# Altium project nRF51822.PrjPcb
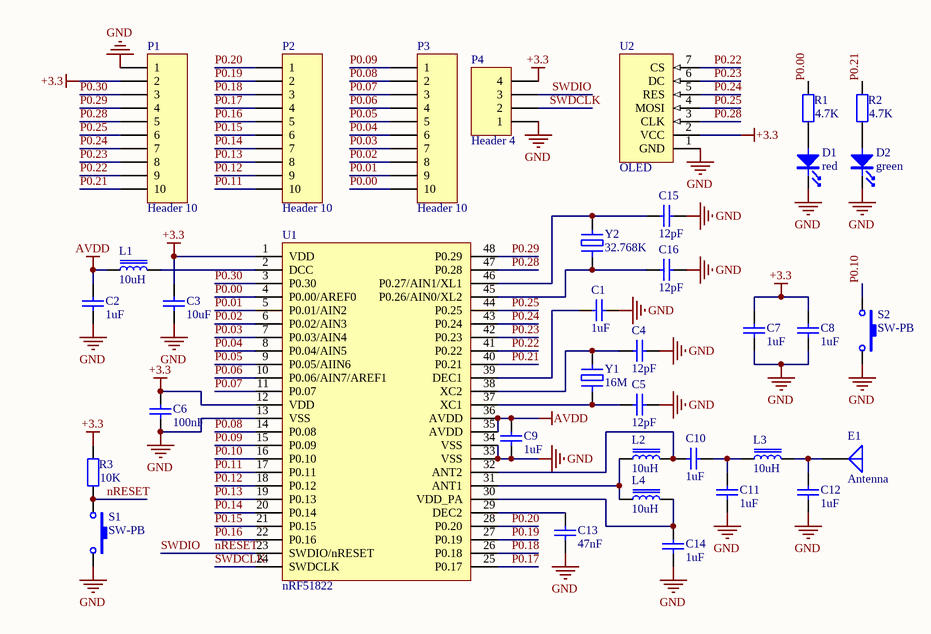
[diagram p0: nRF51822.SchDoc]
1 sheet, 36 parts. Net scope: global (net labels, ports and power ports of the same name join across sheets).
Board file: nRF51822.PcbDoc

## Sheet nRF51822.SchDoc
size A4

### Parts
C1  1uF  [电容_C0603]
C2  1uF  [电容_C0603]
C3  10uF  [电容_C0603]
C4  12pF  [电容_C0603]
C5  12pF  [电容_C0603]
C6  100nF  [电容_C0603]
C7  1uF  [电容_C0603]
C8  1uF  [电容_C0603]
C9  1uF  [电容_C0603]
C10  1uF  [电容_C0603]
C11  1uF  [电容_C0603]
C12  1uF  [电容_C0603]
C13  47nF  [电容_C0603]
C14  1uF  [电容_C0603]
C15  12pF  [电容_C0603]
C16  12pF  [电容_C0603]
D1  red  [LED_0603]
D2  green  [LED_0603]
E1  Antenna  [AN9520]
L1  10uH  [变压器电感_0420]
L2  10uH  [电阻_R0603]
L3  10uH  [电阻_R0603]
L4  10uH  [电阻_R0603]
P1  Header 10  [HDR1X10]
P2  Header 10  [HDR1X10]
P3  Header 10  [HDR1X10]
P4  Header 4  [HDR1X4]
R1  value 4.7K  [电阻_R0603]  (hidden comment: Res2)
R2  value 4.7K  [电阻_R0603]  (hidden comment: Res2)
R3  value 10K  [电阻_R0603]  (hidden comment: Res2)
S1  SW-PB  [SPST4]
S2  SW-PB  [SPST4]
U1  nRF51822  [QFN48 6X6 mm]
U2  OLED  [OLED 0.96]
Y1  F: 16M  [晶振_2016]  (hidden comment: XTAL)
Y2  32.768K  [晶振_3215]

### Nets
+3.3: C3.2 C6.1 C7.2 C8.2 P1.2 P4.4 R3.1 U1.1(VDD) U1.12(VDD) U2.2(VCC)
AVDD: C2.2 C9.1 L1.1 U1.35(AVDD) U1.36(AVDD)
GND: C1.1 C2.1 C3.1 C4.2 C5.2 C6.2 C7.1 C8.1 C9.2 C11.2 C12.2 C13.1 C14.1 C15.2 C16.2 D1.K D2.K P1.1 P4.1 S1.2 S2.2 U1.13(VSS) U1.33(VSS) U1.34(VSS) U2.1(GND)
nRESET: P4.3 R3.2 S1.1 U1.23(SWDIO/nRESET)  [also labelled SWDIO]
P0.00: P3.10 R1.1 U1.4(P0.00/AREF0)
P0.01: P3.9 U1.5(P0.01/AIN2)
P0.02: P3.8 U1.6(P0.02/AIN3)
P0.03: P3.7 U1.7(P0.03/AIN4)
P0.04: P3.6 U1.8(P0.04/AIN5)
P0.05: P3.5 U1.9(P0.05/AIIN6)
P0.06: P3.4 U1.10(P0.06/AIN7/AREF1)
P0.07: P3.3 U1.11(P0.07)
P0.08: P3.2 U1.14(P0.08)
P0.09: P3.1 U1.15(P0.09)
P0.10: S2.1 U1.16(P0.10)
P0.11: P2.10 U1.17(P0.11)
P0.12: P2.9 U1.18(P0.12)
P0.13: P2.8 U1.19(P0.13)
P0.14: P2.7 U1.20(P0.14)
P0.15: P2.6 U1.21(P0.15)
P0.16: P2.5 U1.22(P0.16)
P0.17: P2.4 U1.25(P0.17)
P0.18: P2.3 U1.26(P0.18)
P0.19: P2.2 U1.27(P0.19)
P0.20: P2.1 U1.28(P0.20)
P0.21: P1.10 R2.1 U1.40(P0.21)
P0.22: P1.9 U1.41(P0.22) U2.7(CS)
P0.23: P1.8 U1.42(P0.23) U2.6(DC)
P0.24: P1.7 U1.43(P0.24) U2.5(RES)
P0.25: P1.6 U1.44(P0.25) U2.4(MOSI)
P0.28: P1.5 U1.47(P0.28) U2.3(CLK)
P0.29: P1.4 U1.48(P0.29)
P0.30: P1.3 U1.3(P0.30)
SWDCLK: P4.2 U1.24(SWDCLK)
NetC1_2: C1.2 U1.39(DEC1)
NetC4_1: C4.1 U1.38(XC2) Y1.2
NetC5_1: C5.1 U1.37(XC1) Y1.1
NetC10_1: C10.1 C11.1 L3.1
NetC10_2: C10.2 L2.2 U1.32(ANT2)
NetC12_1: C12.1 E1.1(A) L3.2
NetC13_2: C13.2 U1.29(DEC2)
NetC14_2: C14.2 L4.2 U1.30(VDD_PA)
NetC15_1: C15.1 U1.46(P0.27/AIN1/XL1) Y2.2
NetC16_1: C16.1 U1.45(P0.26/AIN0/XL2) Y2.1
NetD1_A: D1.A R1.2
NetD2_A: D2.A R2.2
NetL1_2: L1.2 U1.2(DCC)
NetL2_1: L2.1 L4.1 U1.31(ANT1)

### Library data of the parts
C1-C16 = cap: U: 50V; 参数: Cap,0805,X7R,104K,50V,125C,±10%
  C1 C2 C7-C12 C14: C: 1uF
  C3: C: 10uF
  C4 C5 C15 C16: C: 12pF
  C6: C: 100nF
  C13: C: 47nF
D1 D2 = LED: 参数: LED,0603,Red
E1 = Antenna: Generic Antenna; Published: 24-Mar-1999; LatestRevisionDate: 17-Jul-2002; LatestRevisionNote: Re-released for DXP Platform.; PackageReference: PIN1; Publisher: Altium Limited
L1-L4 = Inductor Iron 2: _Current: 10A; _Accuracy: 20%; _Footprint: 1040; _Name: IND; _Specification: IND,1040,10uH,10A,20%; _Comma: ,; _Value: 10uH
P1-P3 = Header 10: Header, 10-Pin; LatestRevisionDate: 17-Jul-2002; LatestRevisionNote: Re-released for DXP Platform.; Publisher: Altium Limited
P4 = Header 4: Header, 4-Pin; LatestRevisionDate: 17-Jul-2002; LatestRevisionNote: Re-released for DXP Platform.; Publisher: Altium Limited
R1-R3 = Res2: Resistor; Published: 8-Jun-2000; LatestRevisionDate: 17-Jul-2002; LatestRevisionNote: Re-released for DXP Platform.; PackageReference: AXIAL-0.4; Publisher: Altium Limited; PackageDescription: Axial Device, Thru-Hole; 2 Leads; 0.4 in Pin Spacing
S1 S2 = SW-PB: Switch; Published: 24-Mar-1999; LatestRevisionDate: 17-Jul-2002; LatestRevisionNote: Re-released for DXP Platform.; PackageReference: SPST-2; Publisher: Altium Limited; PackageDescription: Switch; 2 Leads
U1 = nRF51822: Multiprotocol Bluetooth® 4.0 low energy/2.4 GHz RF SoC
U2 = OLED_SPI: 1.3寸或0.96寸SPI接口的OLED
Y2 = XTAL_A: _Name: CRYSTALS; _Comma: ,; _Specification: CRYSTALS,32.768K,*,10ppm,12pF; _Accuracy: 10ppm; _CL: 12pF; _Footprint: *; _Frequency: 32.768K